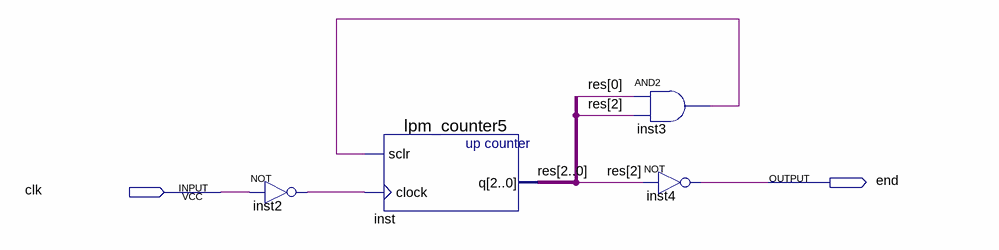
[diagram p0: schematic sheet]
// Quartus schematic block1.bdf as structural Verilog: 4 symbols, 2 pins
module block1 (
  input  clk,
  output \end 
);

  wire inst2_out, inst3_out;
  wire [2:0] res;

  not inst2 (inst2_out, clk);
  lpm_counter5 inst (.sclr(inst3_out), .clock(inst2_out), .q(res));
  and inst3 (inst3_out, res[0], res[2]);
  not inst4 (\end , res[2]);
endmodule
